# EAGLE design helen-circle (EAGLE 6.6.0)
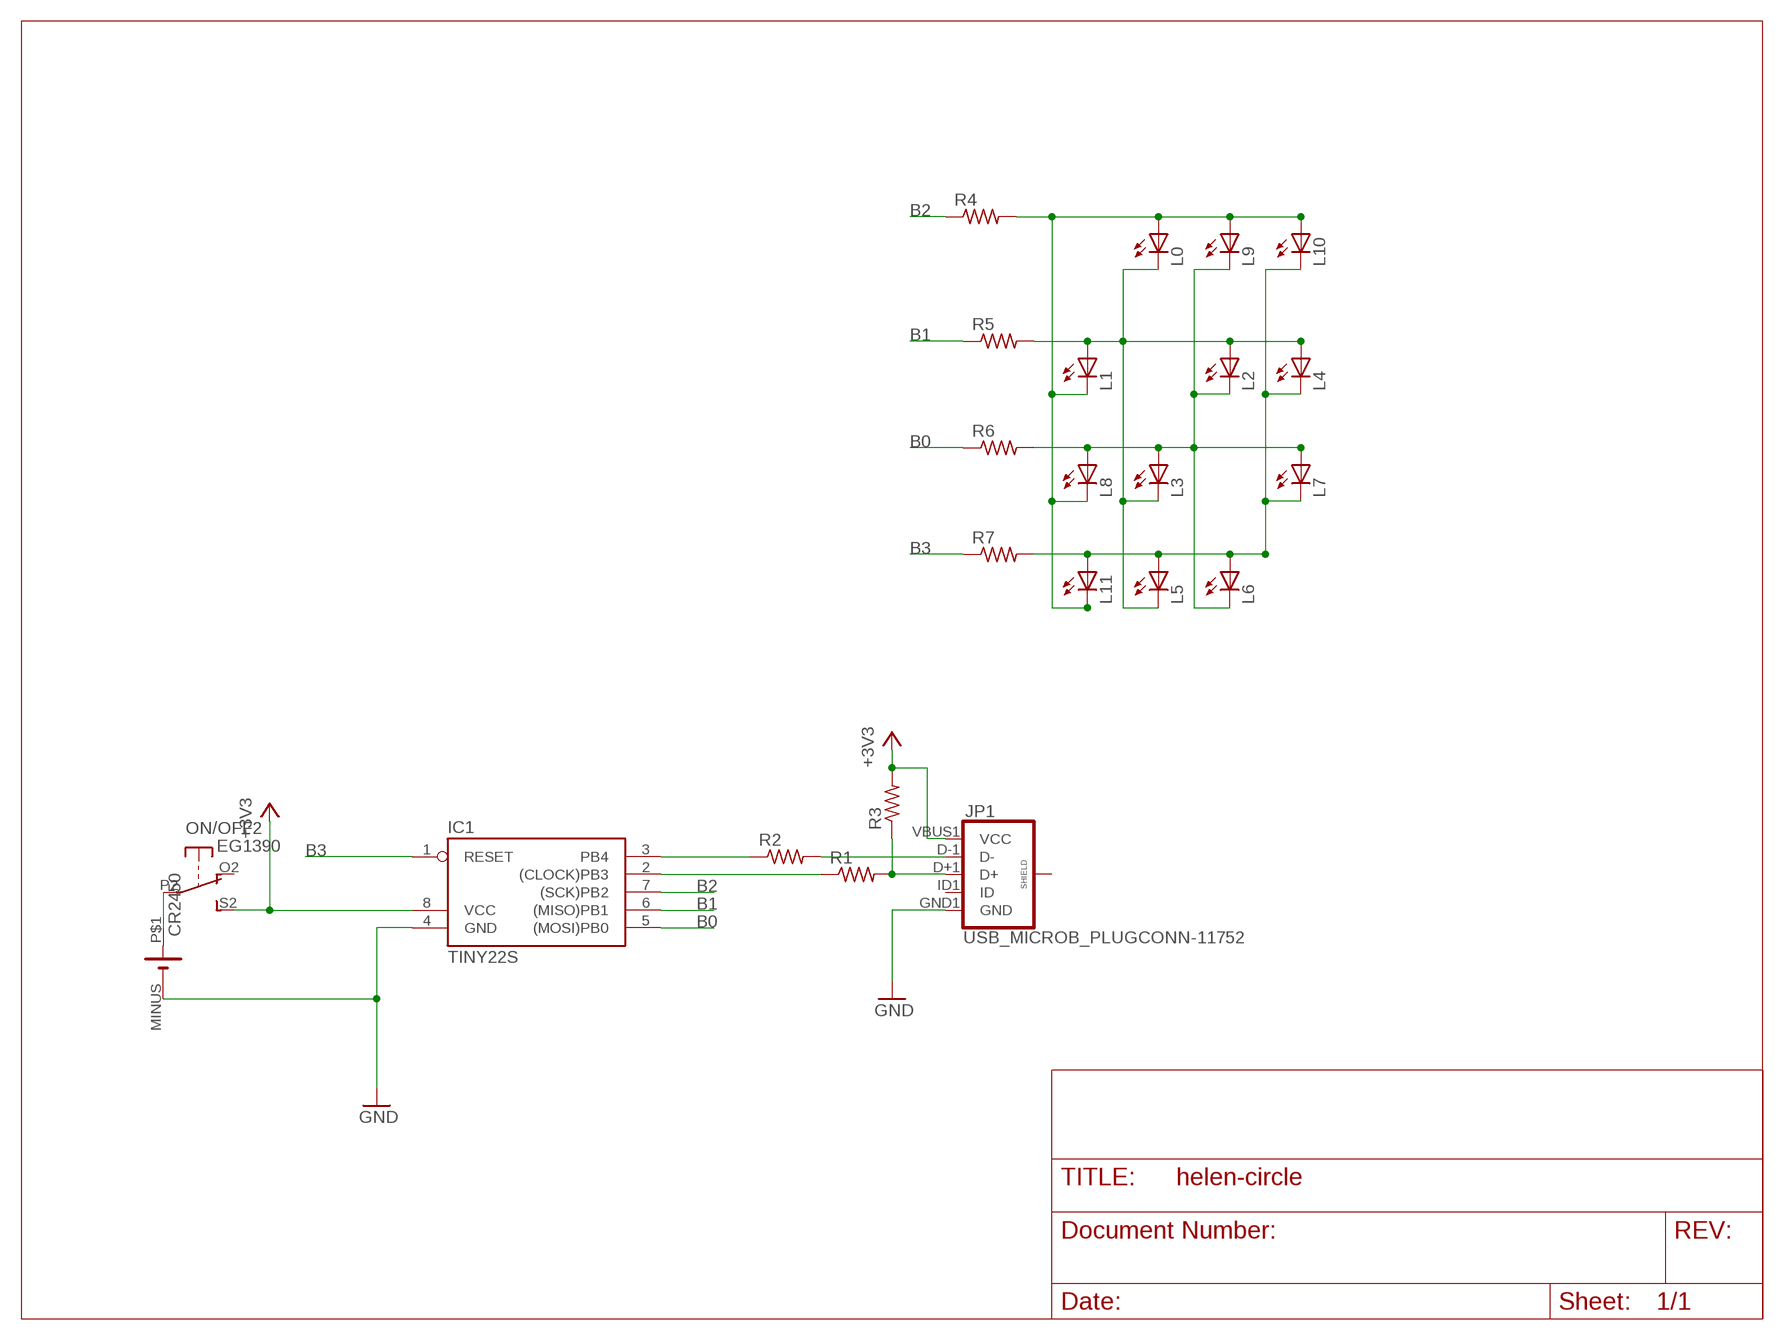
[diagram p0: schematic, sheet 1]

## Parts
IC1  TINY22S  [SOIC8]
JP1  USB_MICROB_PLUGCONN-11752  [USB-B-MICRO-SMD_V03]
L0  LEDCHIPLED_0805  [CHIPLED_0805]
L1  LEDCHIPLED_0805  [CHIPLED_0805]
L2  LEDCHIPLED_0805  [CHIPLED_0805]
L3  LEDCHIPLED_0805  [CHIPLED_0805]
L4  LEDCHIPLED_0805  [CHIPLED_0805]
L5  LEDCHIPLED_0805  [CHIPLED_0805]
L6  LEDCHIPLED_0805  [CHIPLED_0805]
L7  LEDCHIPLED_0805  [CHIPLED_0805]
L8  LEDCHIPLED_0805  [CHIPLED_0805]
L9  LEDCHIPLED_0805  [CHIPLED_0805]
L10  LEDCHIPLED_0805  [CHIPLED_0805]
L11  LEDCHIPLED_0805  [CHIPLED_0805]
ON/OFF  EG1390  DPDT-EG1390  [EG1390]
R1  R-US_R0603  [R0603]
R2  R-US_R0603  [R0603]
R3  R-US_R0603  [R0603]
R4  R-US_R0603  [R0603]
R5  R-US_R0603  [R0603]
R6  R-US_R0603  [R0603]
R7  R-US_R0603  [R0603]
U$3  CR2450  CR2450_KEYSTONE  [CR2450_KEYSTONE]

## Nets
+3V3: IC1.8(VCC) JP1.VBUS1(VCC) ON/OFF.S2(2:S) R3.2
B0: IC1.5((MOSI)PB0) R6.1
B0': L2.C L3.A L6.C L7.A L8.A L9.C R6.2
B1: IC1.6((MISO)PB1) R5.1
B1': L0.C L1.A L2.A L3.C L4.A L5.C R5.2
B2: IC1.7((SCK)PB2) R4.1
B2': L0.A L1.C L8.C L9.A L10.A L11.C R4.2
B3: IC1.1(RESET) R7.1
B3': L4.C L5.A L6.A L7.C L10.C L11.A R7.2
GND: IC1.4(GND) JP1.GND1(GND) U$3.MINUS(-)
N$1: JP1.D+1(D+) R1.2 R3.1
N$2: JP1.D-1(D-) R2.2
N$3: IC1.2((CLOCK)PB3) R1.1
N$4: IC1.3(PB4) R2.1
N$5: ON/OFF.P2(2:P) U$3.P$1(+)
Unconnected: JP1.ID1(ID) JP1.SHIELD1(SHIELD) JP1.SHIELD2(SHIELD) JP1.SHIELD3(SHIELD) ON/OFF.O1(1:O) ON/OFF.O2(2:O) ON/OFF.P1(1:P) ON/OFF.S1(1:S)

## Library data of the parts
IC1 = atmel:TINY22: MICROCONTROLLER 1K ROM 128 bytes RAM 128 bytes EEPROM; OC_FARNELL: unknown; OC_NEWARK: unknown
JP1 = SparkFun-Connectors:USB_MICROB_PLUG: USB Micro-B connectors Some male, some female. Watch your step!; PROD_ID: CONN-11752
L0 L1-L11 = led:LED: LED OSRAM: - CHIPLED LG R971, LG N971, LY N971, LG Q971, LY Q971, LO R971, LY R971 LH N974, LH R974 LS Q976, LO Q976, LY Q976 LO Q996 - Hyper CHIPLED LW Q18S LB Q993, LB Q99A, LB R99A - SideLED LS A670, LO A670, LY A670, LG A670, LP A670 LB A673, LV A673, LT A673, LW A673 LH A674 LY A675 LS A676, LA A676, LO A676, LY A676, LW A676 LS A679, LY A679, LG A679 - Hyper Micro SIDELED® LS Y876, LA Y876, LO Y876, LY Y876 LT Y87S - SmartLED LW L88C, LW L88S LB L89C, LB L89S, LG L890 LS L89K, LO L89K, LY L89K LS L896, LA L896, LO L896, LY L896 - TOPLED LS T670, LO T670, LY T670, LG T670, LP T670 LSG T670, LSP T670, LSY T670, LOP T670, LYG T670 LG T671, LOG T671, LSG T671 LB T673, LV T673, LT T673, LW T673 LH T674 LS T676, LA T676, LO T676, LY T676, LB T676, LH T676, LSB T676, LW T676 LB T67C, LV T67C, LT T67C, LS T67K, LO T67K, LY T67K, LW E67C LS E67B, LA E67B, LO E67B, LY E67B, LB E67C, LV E67C, LT E67C LW T67C LS T679, LY T679, LG T679 LS T770, LO T770, LY T770, LG T770, LP T770 LB T773, LV T773, LT T773, LW T773 LH T774 LS E675, LA E675, LY E675, LS T675 LS T776, LA T776, LO T776, LY T776, LB T776 LHGB T686 LT T68C, LB T68C - Hyper Mini TOPLED® LB M676 - Mini TOPLED Santana® LG M470 LS M47K, LO M47K, LY M47K Source: http://www.osram.convergy.de LUXEON: - LUMILED® LXK2-PW12-R00, LXK2-PW12-S00, LXK2-PW14-U00, LXK2-PW14-V00 LXK2-PM12-R00, LXK2-PM12-S00, LXK2-PM14-U00 LXK2-PE12-Q00, LXK2-PE12-R00, LXK2-PE12-S00, LXK2-PE14-T00, LXK2-PE14-U00 LXK2-PB12-K00, LXK2-PB12-L00, LXK2-PB12-M00, LXK2-PB14-N00, LXK2-PB14-P00, LXK2-PB14-Q00 LXK2-PR12-L00, LXK2-PR12-M00, LXK2-PR14-Q00, LXK2-PR14-R00 LXK2-PD12-Q00, LXK2-PD12-R00, LXK2-PD12-S00 LXK2-PH12-R00, LXK2-PH12-S00 LXK2-PL12-P00, LXK2-PL12-Q00, LXK2-PL12-R00 Source: www.luxeon.com KINGBRIGHT: KA-3528ASYC Source: www.kingbright.com
ON/OFF = adafruit:DPDT
R1-R7 = resistor:R-US_: RESISTOR, American symbol
U$3 = _custom:CR2450_KEYSTONE

## Board
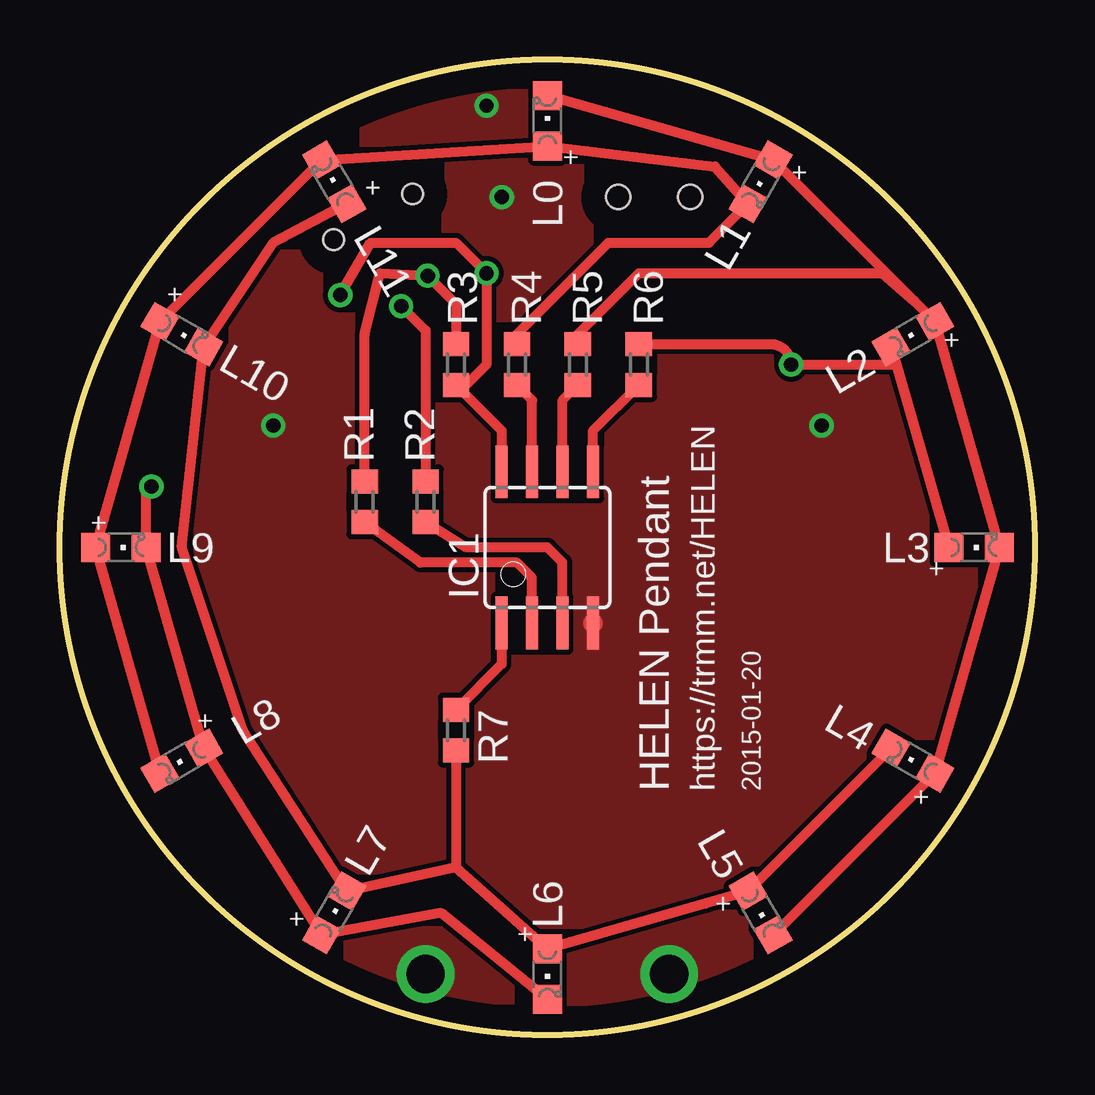
[diagram p1: board, top side]
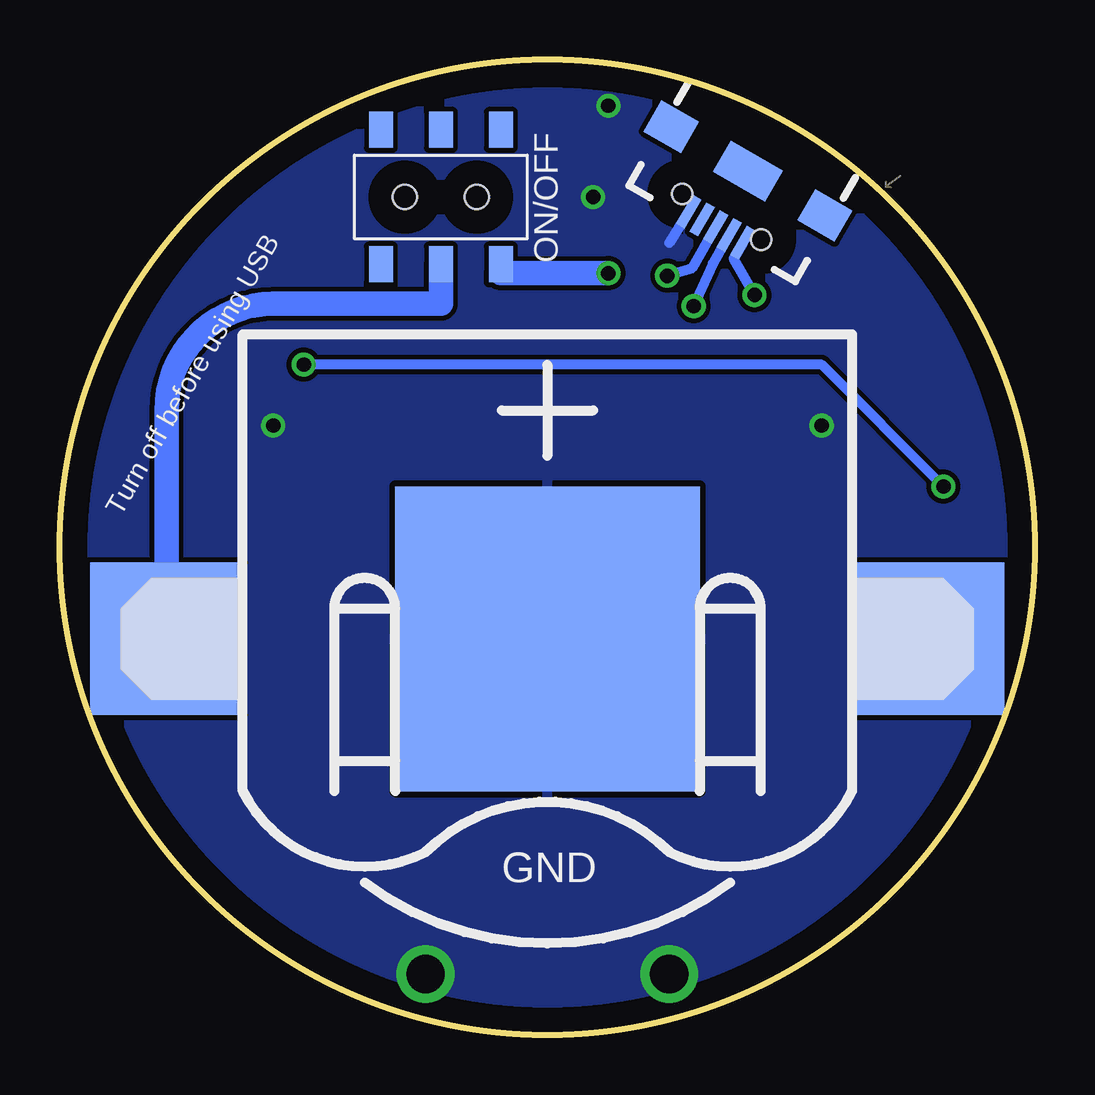
[diagram p2: board, bottom side, seen from below]

Size 40.64 x 40.64 mm. Coordinates in mm from the lower left corner, seen from the top.
Outline: circle at 20.32,20.32 radius 20.32
Copper layers (1*16): Top 0.035mm / dielectric 1.5mm / Bottom 0.035mm
Design rules "default": minimum track width 10mil, minimum drill 24mil, track to track 8mil, track to pad 8mil, pad to pad 8mil, via to via 8mil, smd to smd 8mil, copper to edge 40mil, drill to drill 8mil, minimum pad ring 10mil, minimum via ring 8mil, stop-mask expansion 4mil, vias tented up to drill 0mil, thermal gap 10mil
bKeepout: area 14,10.2 to 26.7,22.9

### Footprints (pad centres in the part's own frame; a part is rotated, then mirrored left to right if it is on the bottom)
SOIC8 = smd 0.5 x 2.2: 1 -1.905,-3.154; 2 -0.645,-3.154; 3 0.625,-3.154; 4 1.895,-3.154; 5 1.905,3.154; 6 0.635,3.154; 7 -0.635,3.154; 8 -1.905,3.154
USB-B-MICRO-SMD_V03 = smd 1.4 x 0.4: D+1 2.7,0; D-1 2.7,0.65; GND1 2.7,-1.3; ID1 2.7,-0.65; VBUS1 2.7,1.3 | smd 1.5 x 1.8: SHIELD1 0,3.7; SHIELD2 0,-3.7 | smd 1.5 x 2.5: SHIELD3 0,0 | hole 0.85: 2.2,1.9; 2.2,-1.9
CHIPLED_0805 = smd 1.2 x 1.2: A 0,-1.05; C 0,1.05
EG1390 = smd 1 x 1.5: O1 -2.5,2.8; O2 -2.5,-2.8; P1 0,2.8; P2 0,-2.8; S1 2.5,2.8; S2 2.5,-2.8 | hole 1: 1.5,0; -1.5,0
R0603 = smd 1 x 1.1: 1 -0.85,0; 2 0.85,0
CR2450_KEYSTONE = smd 12.7 x 12.7: MINUS 0,0 | smd 6.35 x 6.35: P$1 -15.875,0; P$2 15.875,0

### Placement (x,y rotation side)
IC1  20.32,20.32 0 top
JP1  11.96,36.01 240 bottom
L0  20.32,38.1 0 top
L1  29.21,35.56 150 top
L2  35.56,29.21 120 top
L3  38.1,20.32 270 top
L4  35.56,11.43 60 top
L5  29.21,5.08 210 top
L6  20.32,2.54 180 top
L7  11.43,5.08 330 top
L8  5.08,11.43 120 top
L9  2.54,20.32 270 top
L10  5.08,29.21 240 top
L11  11.43,35.56 30 top
ON/OFF  24.77,34.93 0 bottom
R1  12.7,22.23 90 top
R2  15.24,22.23 90 top
R3  16.51,27.94 270 top
R4  19.05,27.94 90 top
R5  21.59,27.94 90 top
R6  24.13,27.94 90 top
R7  16.51,12.7 270 top
U$3  20.32,16.51 0 bottom

### Tracks (layer width: path | path; a pad name or v marks a point on that pad's centre or on a via)
+3V3  (via drill 0.6)
  Top 0.406: v11.69,30.84 12.96,33.02 16.51,33.02 v17.78,31.75 17.78,27.94 16.93,27.09 R3.2 18.42,25.19 IC1.8
  Bottom 0.406: JP1.VBUS1 12.56,32.37 v11.69,30.84 | ON/OFF.S2 22.27,31.75
  Bottom 1.016: 22.27,31.75 v17.78,31.75
B0
  Top 0.406: IC1.5 22.23,25.19 R6.1
B0'  (via drill 0.6)
  Top 0.406: L6.C 15.88,5.08 L7.A L8.A L9.C | 34.82,28.09 L2.C 34.55,28.79 | 34.82,28.09 L3.A | L9.C 3.81,20.32 | L9.C 3.59,22.64 v3.81,22.86 | R6.2 29.63,28.79 arc-90 v30.48,27.94 34.67,27.94 arc90 34.82,28.09
  Bottom 0.406: v3.81,22.86 8.89,27.94 v30.48,27.94
B1
  Top 0.406: IC1.6 20.96,26.46 R5.1
B1'
  Top 0.406: L5.C L4.A L3.C L2.A 35.64,30.56 | L0.C L1.A 35.64,30.56 | R5.2 21.59,29.21 24.13,31.75 34.29,31.75 35.64,30.56
B2
  Top 0.406: IC1.7 19.69,26.46 R4.1
B2'
  Top 0.406: L8.C L9.A L10.A L11.C L0.A 27.3,36.2 L1.C 27.05,33.02 22.86,33.02 19.05,29.21 R4.2
B3
  Top 0.406: IC1.1 18.42,15.46 R7.1
B3'
  Top 0.406: L4.C L5.A 26.92,5.48 L6.A 16.51,6.99 | L11.A 8.89,33.02 L10.C 5.08,20.32 7.62,12.7 L7.C 16.51,6.99 | R7.2 16.51,6.99
GND  (via drill 0.6, 1.6)
  Top 0.813: IC1.4 22.23,17.16
  Bottom 0.406: JP1.GND1 15.24,33.02
  other vias: 15.24,2.54 25.4,2.54 8.89,25.4 17.78,38.73 18.42,34.93 31.75,25.4
  pour Bottom: -3.81,44.45 43.18,44.45 43.18,-1.27 -3.81,-1.27
  pour Top: -2.54,44.45 44.45,44.45 44.45,0 -2.54,0
N$1  (via drill 0.6)
  Top 0.406: R1.2 12.7,29.21 13.34,31.75 v15.33,31.65 16.51,30.46 R3.1
  Bottom 0.406: JP1.D+1 14.3,31.94 v15.33,31.65
N$2  (via drill 0.6)
  Top 0.406: v14.23,30.38 15.24,29.36 R2.2
  Bottom 0.406: JP1.D-1 13.43,32.16 v14.23,30.38
N$3
  Top 0.406: IC1.2 19.68,19.06 19.05,19.69 15.03,19.69 R1.1
N$4
  Top 0.406: IC1.3 20.95,19.7 20.32,20.32 16.93,20.32 R2.1
N$5
  Bottom 1.016: U$3.P$1 36.2,26.04 arc90 31.75,30.48 24.77,30.48 ON/OFF.P2

### Text on the board
tNames: + | + | + | + | + | + | + | + | HELEN Pendant | https://trmm.net/HELEN | 2015-01-20 | + | + | + | +
bNames: Turn off before using USB | GND